# EAGLE design Robotic_Finger_Sensor (EAGLE 9.0.1)
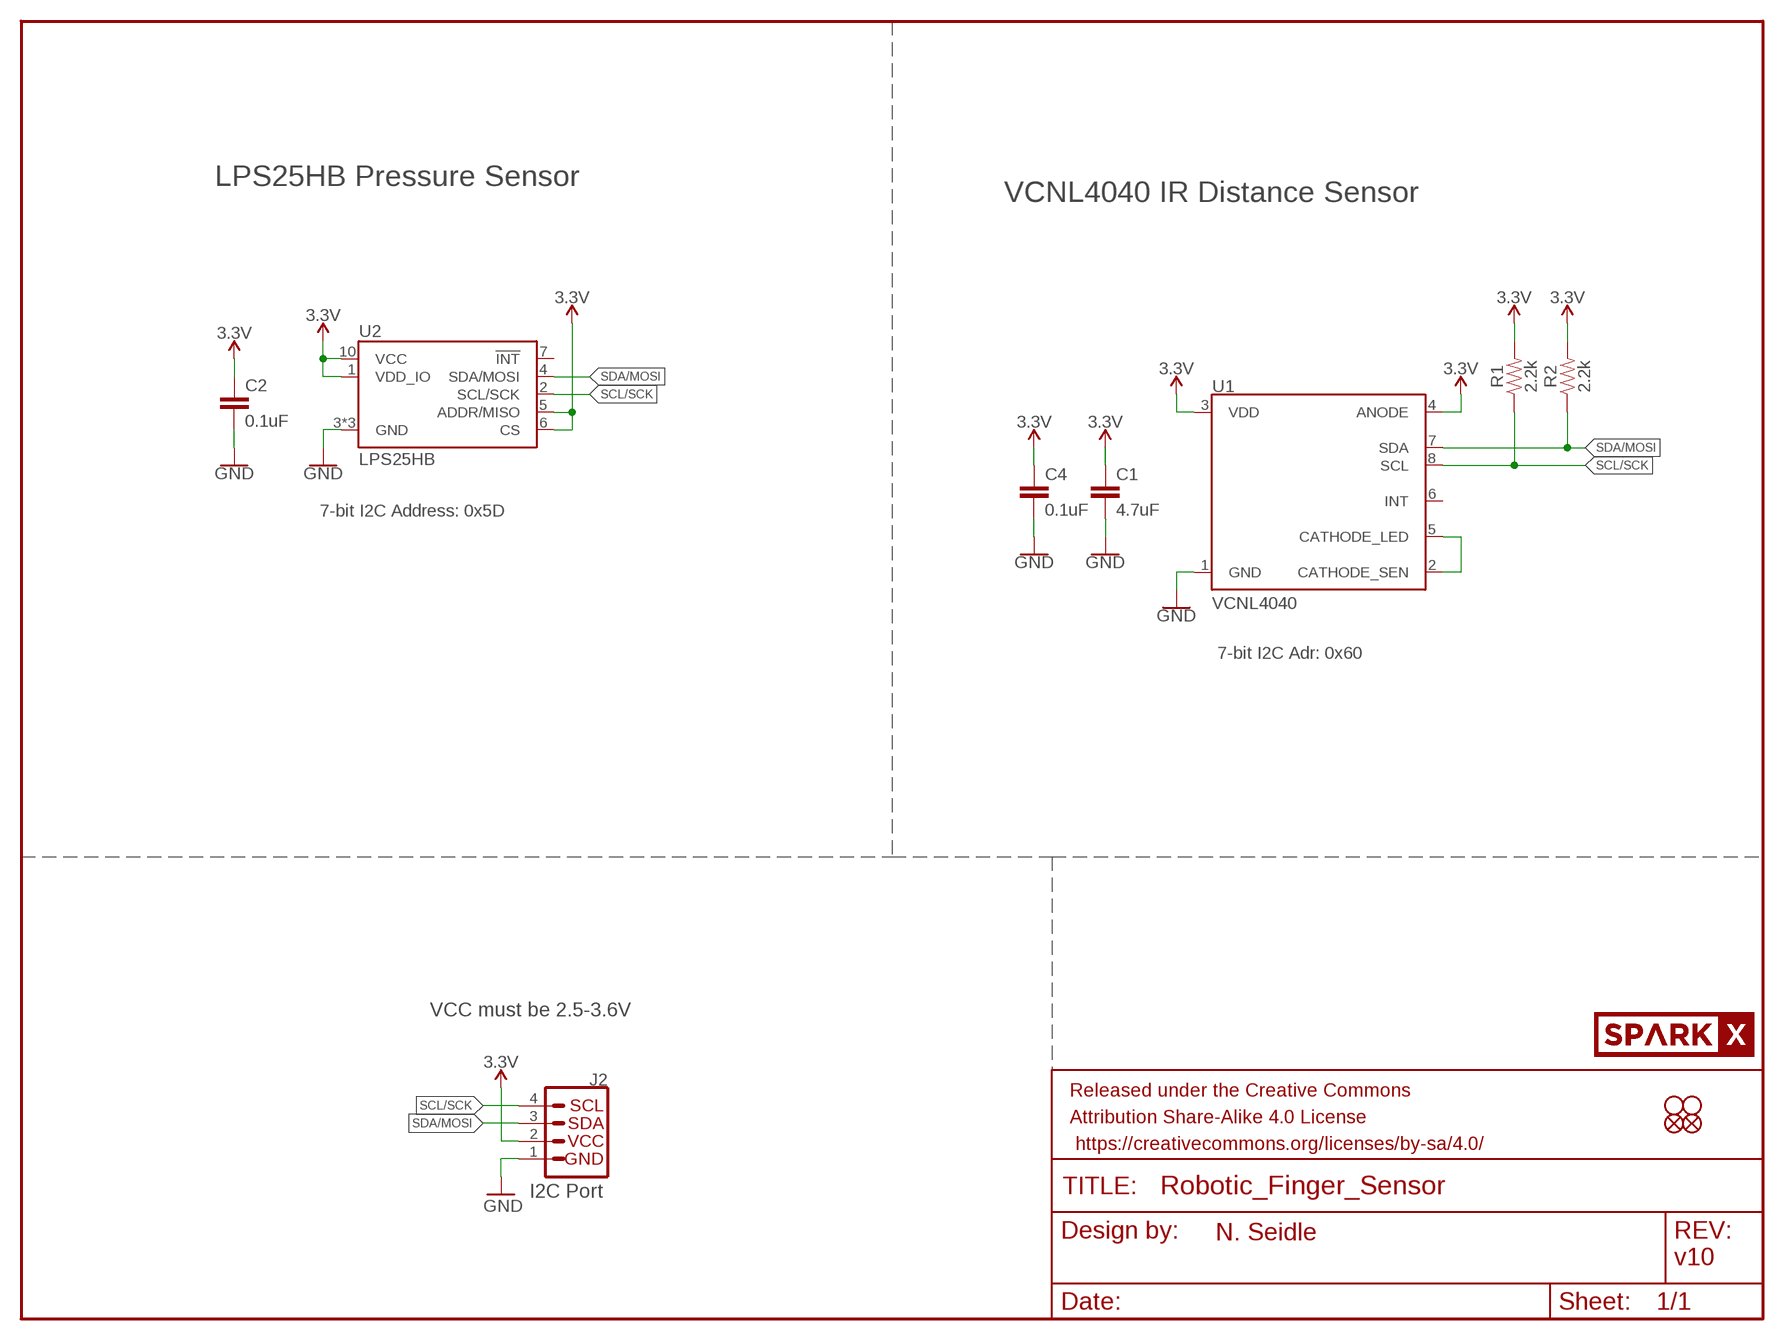
[diagram p0: schematic, sheet 1]

## Parts
C1  4.7uF  4.7UF0603  [0603]
C2  0.1uF  0.1UF-0603-25V-(+80/-20%)  [0603]
C4  0.1uF  0.1UF-0603-25V-(+80/-20%)  [0603]
FD1  FIDUCIALUFIDUCIAL  [FIDUCIAL-MICRO]
FD2  FIDUCIALUFIDUCIAL  [FIDUCIAL-MICRO]
FRAME2  FRAME-LETTER  [CREATIVE_COMMONS]
J2  I2C_STANDARDJS-1MM  [1X04_1MM_RA]
R1  2.2k  2.2KOHM-0603-1/10W-1%  [0603]
R2  2.2k  2.2KOHM-0603-1/10W-1%  [0603]
U1  VCNL4040  [VCNL4040]
U2  LPS25HB  [LPS25HB]
U$2  SPARKX-LOGO3  [SPARKX-SMALL]
U$3  STAND-OFF  [STAND-OFF-#2]
U$4  STAND-OFF  [STAND-OFF-#2]

## Nets
3.3V: C1.1 C2.1 C4.1 J2.2(VCC) R1.2 R2.2 U1.3(VDD) U1.4(ANODE) U2.1(VDD_IO) U2.5(ADDR/MISO) U2.6(CS) U2.10(VCC)
GND: C1.2 C2.2 C4.2 J2.1(GND) U1.1(GND) U2.3(GND) U2.8(GND) U2.9(GND)
N$1: U1.2(CATHODE_SEN) U1.5(CATHODE_LED)
SCL/SCK: J2.4(SCL) R1.1 U1.8(SCL) U2.2(SCL/SCK)
SDA/MOSI: J2.3(SDA) R2.1 U1.7(SDA) U2.4(SDA/MOSI)
Unconnected: U1.6(INT) U2.7(!INT)

## Notes on the sheet
- LPS25HB Pressure Sensor
- VCNL4040 IR Distance Sensor
- 7-bit I2C Address: 0x5D
- 7-bit I2C Adr: 0x60
- VCC must be 2.5-3.6V
- I2C Port
- N. Seidle
- v10

## Library data of the parts
C1 = SparkFun-Capacitors:4.7UF: 4.7µF ceramic capacitors A capacitor is a passive two-terminal electrical component used to store electrical energy temporarily in an electric field.; PROD_ID: CAP-08280
C2 C4 = SparkFun-Capacitors:0.1UF: 0.1µF ceramic capacitors A capacitor is a passive two-terminal electrical component used to store electrical energy temporarily in an electric field.; PROD_ID: CAP-00810
FD1 FD2 = SparkFun-Aesthetics:FIDUCIAL: Fiducial Alignment Points Point-of-reference for pick-and-place machines and other optical instruments.
FRAME2 = SparkFun-Aesthetics:FRAME-LETTER: Schematic Frame Standard 8.5x11 US Letter frame
J2 = SparkX:I2C_STANDARD: SparkFun I2C Standard Pinout Header SparkFun has standardized on a pinout for all I2C based sensor breakouts. This pinout allows I2C boards to be plugged directly into the headers on Arduino Uno compatible boards, and to be daisy chained easily. Example SparkFun Products: SparkFun Atmospheric Sensor Breakout - BME280 <https://www.sparkfun.com/products/13676> SparkFun Altitude/Pressure Sensor Breakout - MPL3115A2 <https://www.sparkfun.com/products/11084> SparkFun TOF Range Finder Sensor - VL6180 <https://www.sparkfun.com/products/12785>
R1 R2 = SparkFun-Resistors:2.2KOHM: 2.2kΩ resistor A resistor is a passive two-terminal electrical component that implements electrical resistance as a circuit element. Resistors act to reduce current flow, and, at the same time, act to lower voltage levels within circuits. - Wikipedia; PROD_ID: RES-08272
U1 = SparkX:VCNL4040
U2 = LPS25HB:LPS25HB
U$2 = SparkX:SPARKX-LOGO
U$3 U$4 = SparkX:STAND-OFF

## Board
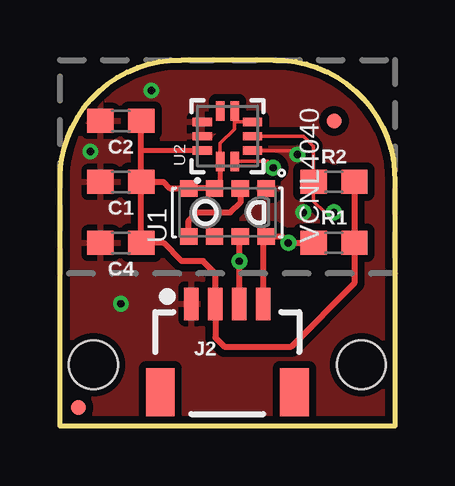
[diagram p1: board, top side]
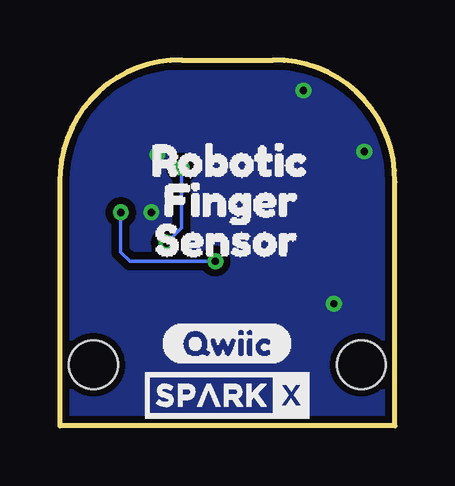
[diagram p2: board, bottom side, seen from below]

Size 13.97 x 15.24 mm. Coordinates in mm from the lower left corner, seen from the top.
Outline: 0,0 13.97,0 13.97,10.16 arc92 8.89,15.24 5.08,15.24 arc92 0,10.16 0,0
Copper layers (1*16): Top 0.035mm / dielectric 1.5mm / Bottom 0.035mm
Design rules "SparkFun-2-layer-PCBWay-LIMIT": minimum track width 6mil, minimum drill 0.3mm, track to track 6mil, track to pad 6mil, pad to pad 6mil, via to via 6mil, smd to smd 6mil, copper to edge 6mil, drill to drill 6mil, minimum pad ring 7mil, minimum via ring 7mil, stop-mask expansion 4mil, vias tented up to drill 25mil, thermal gap 10mil

### Footprints (pad centres in the part's own frame; a part is rotated, then mirrored left to right if it is on the bottom)
0603 = smd 1.1 x 1: 1 -0.85,0; 2 0.85,0
FIDUCIAL-MICRO = smd 0.635 x 0.635: 1 0,0
1X04_1MM_RA = smd 0.6 x 1.35: 1 -1.5,0; 2 -0.5,0; 3 0.5,0; 4 1.5,0 | smd 1.2 x 2: NC1 2.8,-3.675; NC2 -2.8,-3.675
VCNL4040 = smd 0.7 x 0.725: 1 1,-1.613; 2 1,-0.537; 3 1,0.537; 4 1,1.613; 5 -1,1.613; 6 -1,0.537; 7 -1,-0.537; 8 -1,-1.613
LPS25HB = smd 0.8 x 0.35: 1 -1.05,0.3; 2 -1.05,-0.3; 6 1.05,-0.3; 7 1.05,0.3 | smd 0.35 x 0.8: 3 -0.6,-1.05; 4 0,-1.05; 5 0.6,-1.05; 8 0.6,1.05; 9 0,1.05; 10 -0.6,1.05
STAND-OFF-#2 = hole 2.032: 0,0

### Placement (x,y rotation side)
C1  2.54,10.16 180 top
C2  2.54,12.7 180 top
C4  2.54,7.62 180 top
FD1  11.43,12.7 0 top
FD2  0.76,0.76 0 top
FRAME2  -21.59,-20.32 0 top  (outside the outline)
J2  6.99,5.08 0 top
R1  11.43,7.62 0 top
R2  11.43,10.16 0 top
U1  6.99,8.89 90 top
U2  6.99,12.06 90 top
U$2  6.99,1.27 0 bottom
U$3  1.4,2.54 0 top
U$4  12.57,2.54 0 top
U$6  [ROBOTIC0]  11.3,11.05 0 bottom
U$7  [SENSOR2]  11.18,7.75 0 bottom
U$9  [FINGER0]  10.79,9.4 0 bottom
U$11  [(QWIIC)]  9.78,3.43 0 bottom

### Tracks (layer width: path | path; a pad name or v marks a point on that pad's centre or on a via)
3.3V
  Top 0.152: U2.1 6.68,11.77 7.29,12.37 7.29,12.7 | U2.6 7.29,12.7 | U2.5 7.32,12.66 7.29,12.7
  Top 0.203: U2.10 3.42,11.46 3.39,11.43 | U2.1 6.68,10.13 U1.3
  Top 0.254: C4.1 3.39,8.04 3.81,7.62 | C4.1 C1.1 | R2.2 R1.2 12.28,5.93 9.65,3.3 6.86,3.3 6.49,3.67 J2.2 6.49,6.34 5.97,6.86 5.08,6.86 4.32,7.62 C4.1 | U1.3 U1.4 5.36,9.91 4.57,9.91 4.32,10.16 C1.1 | C1.1 3.39,11.43 C2.1
GND  (via drill 0.3)
  Top 0.152: 7.71,11.46 U2.3 9.74,11.46 v9.91,11.3
  other vias: 10.16,8.89 1.27,11.43 2.54,5.08 3.81,13.97
  pour Top (isolate 0.305): 0,0 0,15.24 13.97,15.24 13.97,0
  pour Bottom (isolate 0.305): 0,0 0,15.24 13.97,15.24 13.97,0
N$1
  Top 0.254: U1.5 5.37,8.55 5.71,8.89 7.11,8.89 7.52,9.3 U1.2
SCL/SCK  (via drill 0.3)
  Top 0.152: U2.2 8.67,11.02 8.89,10.79 v8.89,10.75
  Top 0.254: J2.4 8.48,7.78 U1.8 9.26,7.89 v9.53,7.62 R1.1
  Bottom 0.152: v8.89,10.75 8.89,8.26 v9.53,7.62
SDA/MOSI  (via drill 0.3)
  Top 0.152: v11.43,8.89 11.05,8.89 10.58,9.36 R2.1 10.58,11.64 10.16,12.06 U2.4
  Top 0.254: J2.3 v7.49,6.86 7.49,7.85 U1.7
  Bottom 0.152: v11.43,8.89 11.43,7.24 11.05,6.86 v7.49,6.86

### Text on the board
tDocu: GooLine | N. Seidle